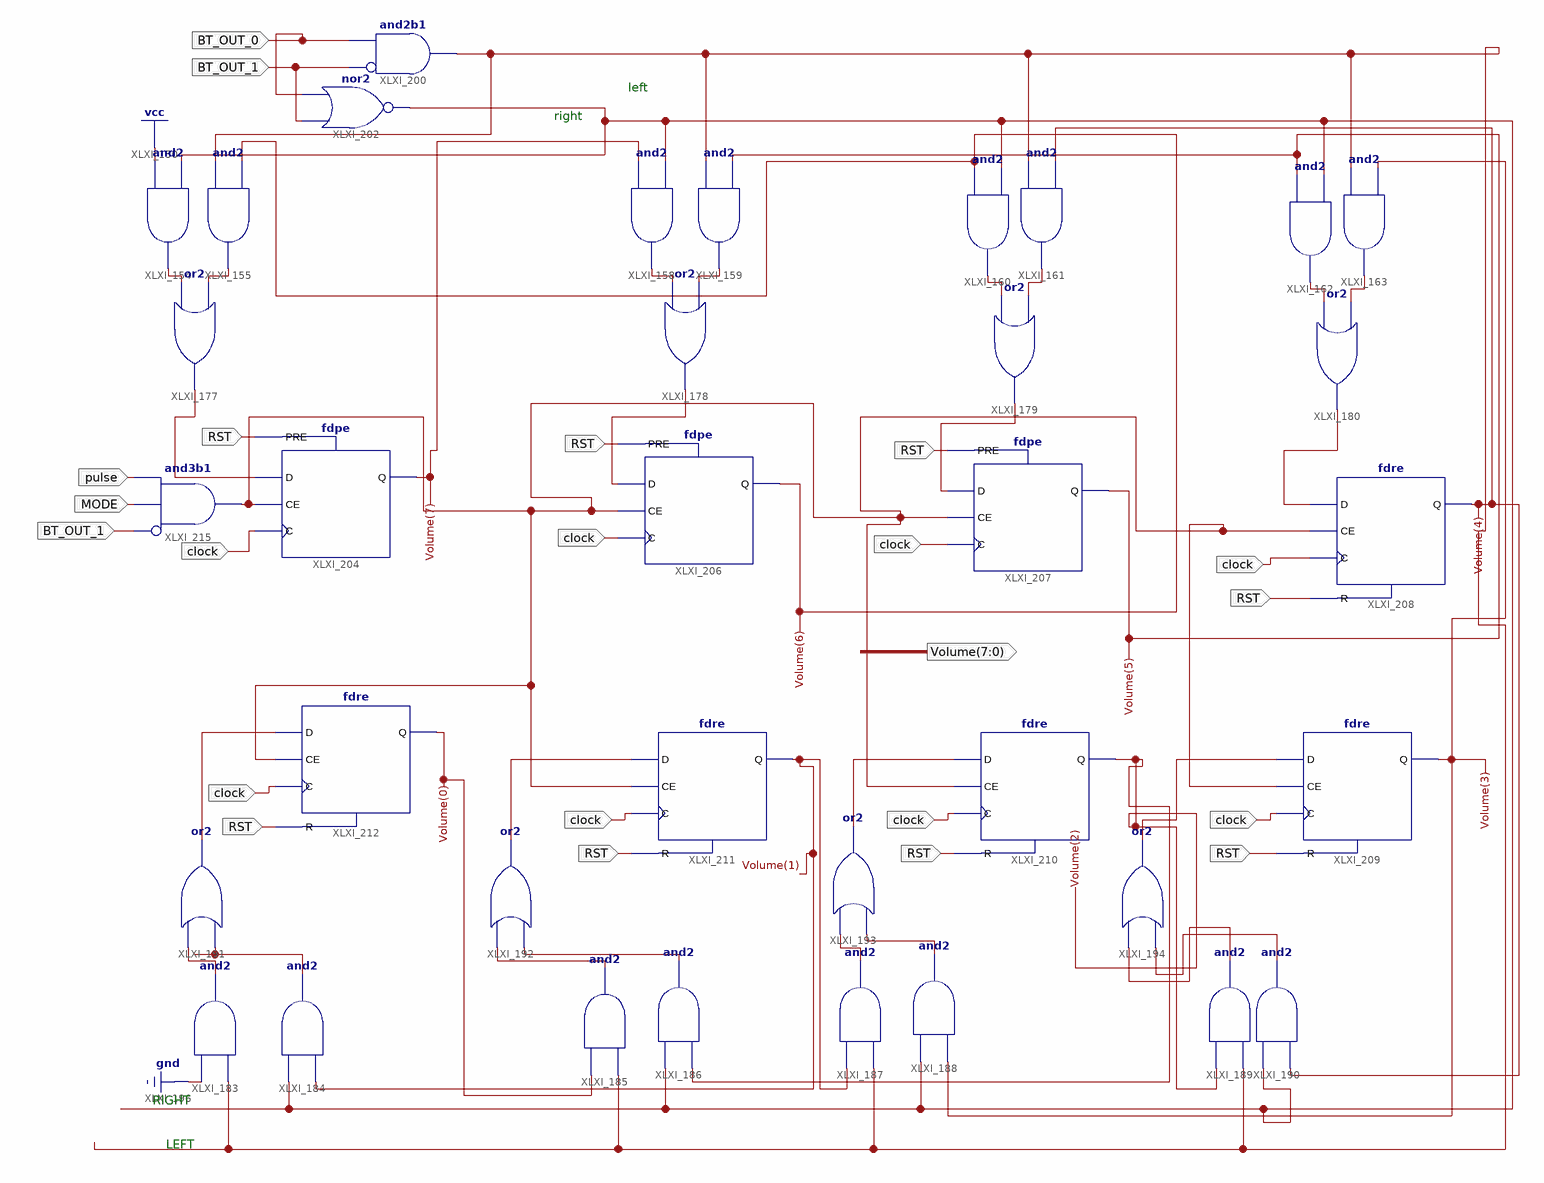
[diagram p0: schematic sheet 1]
// Xilinx ISE schematic volume_control.sch (spartan3e) as structural Verilog: 35 symbols, 7 ports
module volume_control (
  input  clock,
  input  RST,
  input  pulse,
  input  BT_OUT_0,
  input  BT_OUT_1,
  input  MODE,
  output [7:0] Volume
);

  wire Enable, XLXN99911, XLXN_201, XLXN_202, XLXN_204, XLXN_205, XLXN_207, XLXN_208, XLXN_210, XLXN_212,
       XLXN_216, XLXN_217, XLXN_220, XLXN_221, XLXN_222, XLXN_223, XLXN_224, XLXN_225, XLXN_262, XLXN_271,
       XLXN_275, XLXN_292, XLXN_297, XLXN_299, XLXN_300, XLXN_302, XLXN_303;

  and XLXI_154 (XLXN_201, 1'b1, XLXN99911);
  and XLXI_155 (XLXN_202, XLXN_262, Volume[6]);
  and XLXI_158 (XLXN_204, Volume[7], XLXN99911);
  and XLXI_159 (XLXN_205, XLXN_262, Volume[5]);
  and XLXI_160 (XLXN_207, Volume[6], XLXN99911);
  and XLXI_161 (XLXN_208, XLXN_262, Volume[4]);
  and XLXI_162 (XLXN_210, Volume[5], XLXN99911);
  and XLXI_163 (XLXN_212, XLXN_262, Volume[3]);
  or XLXI_177 (XLXN_271, XLXN_201, XLXN_202);
  or XLXI_178 (XLXN_275, XLXN_204, XLXN_205);
  or XLXI_180 (XLXN_297, XLXN_210, XLXN_212);
  and XLXI_183 (XLXN_216, XLXN_262, 1'b0);
  and XLXI_184 (XLXN_217, Volume[1], XLXN99911);
  and XLXI_186 (XLXN_221, Volume[2], XLXN99911);
  and XLXI_187 (XLXN_222, XLXN_262, Volume[1]);
  and XLXI_188 (XLXN_223, Volume[3], XLXN99911);
  and XLXI_189 (XLXN_224, XLXN_262, Volume[2]);
  and XLXI_190 (XLXN_225, Volume[4], XLXN99911);
  or XLXI_191 (XLXN_303, XLXN_217, XLXN_216);
  or XLXI_192 (XLXN_302, XLXN_221, XLXN_220);
  or XLXI_193 (XLXN_300, XLXN_223, XLXN_222);
  or XLXI_194 (XLXN_299, XLXN_225, XLXN_224);
  and XLXI_185 (XLXN_220, XLXN_262, Volume[0]);
  and XLXI_200 (XLXN_262, ~BT_OUT_1, BT_OUT_0);  // and2b1
  nor XLXI_202 (XLXN99911, BT_OUT_1, BT_OUT_0);
  fdpe XLXI_204 (.C(clock), .CE(Enable), .D(XLXN_271), .PRE(RST), .Q(Volume[7]));
  or XLXI_179 (XLXN_292, XLXN_207, XLXN_208);
  fdpe XLXI_206 (.C(clock), .CE(Enable), .D(XLXN_275), .PRE(RST), .Q(Volume[6]));
  fdpe XLXI_207 (.C(clock), .CE(Enable), .D(XLXN_292), .PRE(RST), .Q(Volume[5]));
  fdre XLXI_208 (.C(clock), .CE(Enable), .D(XLXN_297), .R(RST), .Q(Volume[4]));
  fdre XLXI_209 (.C(clock), .CE(Enable), .D(XLXN_299), .R(RST), .Q(Volume[3]));
  fdre XLXI_210 (.C(clock), .CE(Enable), .D(XLXN_300), .R(RST), .Q(Volume[2]));
  fdre XLXI_211 (.C(clock), .CE(Enable), .D(XLXN_302), .R(RST), .Q(Volume[1]));
  fdre XLXI_212 (.C(clock), .CE(Enable), .D(XLXN_303), .R(RST), .Q(Volume[0]));
  and XLXI_215 (Enable, ~BT_OUT_1, MODE, pulse);  // and3b1

  // Notes on the sheet:
  //   left
  //   right
  //   RIGHT
  //   LEFT
endmodule
